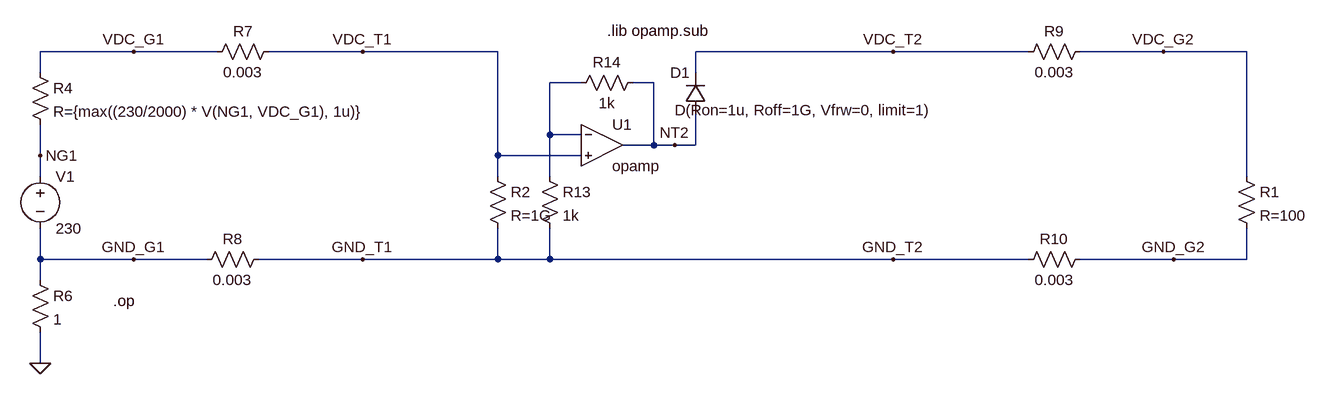
[diagram p0: schematic Transformer__OPA.asc]
Transformer__OPA.asc, the LTspice schematic file:
Version 4
SHEET 1 2104 680
WIRE -320 -80 -464 -80
WIRE -192 -80 -320 -80
WIRE 32 -80 -112 -80
WIRE 240 -80 32 -80
WIRE 848 -80 544 -80
WIRE 1056 -80 848 -80
WIRE 1264 -80 1136 -80
WIRE 1392 -80 1264 -80
WIRE -464 -48 -464 -80
WIRE 544 -48 544 -80
WIRE 368 -32 320 -32
WIRE 480 -32 448 -32
WIRE 320 48 320 -32
WIRE 368 48 320 48
WIRE 480 64 480 -32
WIRE 480 64 432 64
WIRE 512 64 480 64
WIRE 544 64 544 16
WIRE 544 64 512 64
WIRE -464 80 -464 32
WIRE 240 80 240 -80
WIRE 368 80 240 80
WIRE -464 112 -464 80
WIRE 240 112 240 80
WIRE 320 112 320 48
WIRE 1392 112 1392 -80
WIRE -464 240 -464 192
WIRE -320 240 -464 240
WIRE -208 240 -320 240
WIRE 32 240 -128 240
WIRE 240 240 240 192
WIRE 240 240 32 240
WIRE 320 240 320 192
WIRE 320 240 240 240
WIRE 848 240 320 240
WIRE 1056 240 848 240
WIRE 1280 240 1136 240
WIRE 1392 240 1392 192
WIRE 1392 240 1280 240
WIRE -464 272 -464 240
WIRE -464 400 -464 352
FLAG -464 400 0
FLAG -320 -80 VDC_G1
FLAG -320 240 GND_G1
FLAG 848 -80 VDC_T2
FLAG 848 240 GND_T2
FLAG -464 80 NG1
FLAG 32 -80 VDC_T1
FLAG 32 240 GND_T1
FLAG 1264 -80 VDC_G2
FLAG 1280 240 GND_G2
FLAG 512 64 NT2
SYMBOL voltage -464 96 R0
SYMATTR InstName V1
SYMATTR Value 230
SYMBOL res 1376 96 R0
SYMATTR InstName R1
SYMATTR Value R=100
SYMBOL res -480 -64 R0
SYMATTR InstName R4
SYMATTR Value R={max((230/2000) * V(NG1, VDC_G1), 1u)}
SYMBOL res -480 256 R0
SYMATTR InstName R6
SYMATTR Value 1
SYMBOL res -208 -64 R270
WINDOW 0 32 56 VTop 2
WINDOW 3 0 56 VBottom 2
SYMATTR InstName R7
SYMATTR Value 0.003
SYMBOL res -224 256 R270
WINDOW 0 32 56 VTop 2
WINDOW 3 0 56 VBottom 2
SYMATTR InstName R8
SYMATTR Value 0.003
SYMBOL res 1040 -64 R270
WINDOW 0 32 56 VTop 2
WINDOW 3 0 56 VBottom 2
SYMATTR InstName R9
SYMATTR Value 0.003
SYMBOL res 1040 256 R270
WINDOW 0 32 56 VTop 2
WINDOW 3 0 56 VBottom 2
SYMATTR InstName R10
SYMATTR Value 0.003
SYMBOL OpAmps\\opamp 400 0 R0
SYMATTR InstName U1
SYMBOL res 304 96 R0
SYMATTR InstName R13
SYMATTR Value 1k
SYMBOL res 464 -48 R90
WINDOW 0 0 56 VBottom 2
WINDOW 3 32 56 VTop 2
SYMATTR InstName R14
SYMATTR Value 1k
SYMBOL res 224 96 R0
SYMATTR InstName R2
SYMATTR Value R=1G
SYMBOL diode 560 16 R180
WINDOW 0 24 64 Left 2
WINDOW 3 -349 6 Left 2
SYMATTR InstName D1
SYMATTR Value D(Ron=1u, Roff=1G, Vfrw=0, limit=1)
TEXT -352 304 Left 2 !.op
TEXT 408 -112 Left 2 !.lib opamp.sub

The netlist it stands for:
* Transformer__OPA.asc
V1 NG1 GND_G1 230
R1 VDC_G2 GND_G2 R=100
R4 VDC_G1 NG1 R={max((230/2000) * V(NG1, VDC_G1), 1u)}
R6 GND_G1 0 1
R7 VDC_G1 VDC_T1 0.003
R8 GND_G1 GND_T1 0.003
R9 VDC_T2 VDC_G2 0.003
R10 GND_T1 GND_G2 0.003
XU1 N001 VDC_T1 NT2 opamp Aol=100K GBW=10Meg  ; pins invin noninvin out
R13 N001 GND_T1 1k
R14 NT2 N001 1k
R2 VDC_T1 GND_T1 R=1G
D1 NT2 VDC_T2 D(Ron=1u, Roff=1G, Vfrw=0, limit=1)
.model D D
.lib standard.dio
.op
.lib opamp.sub
.backanno
.end